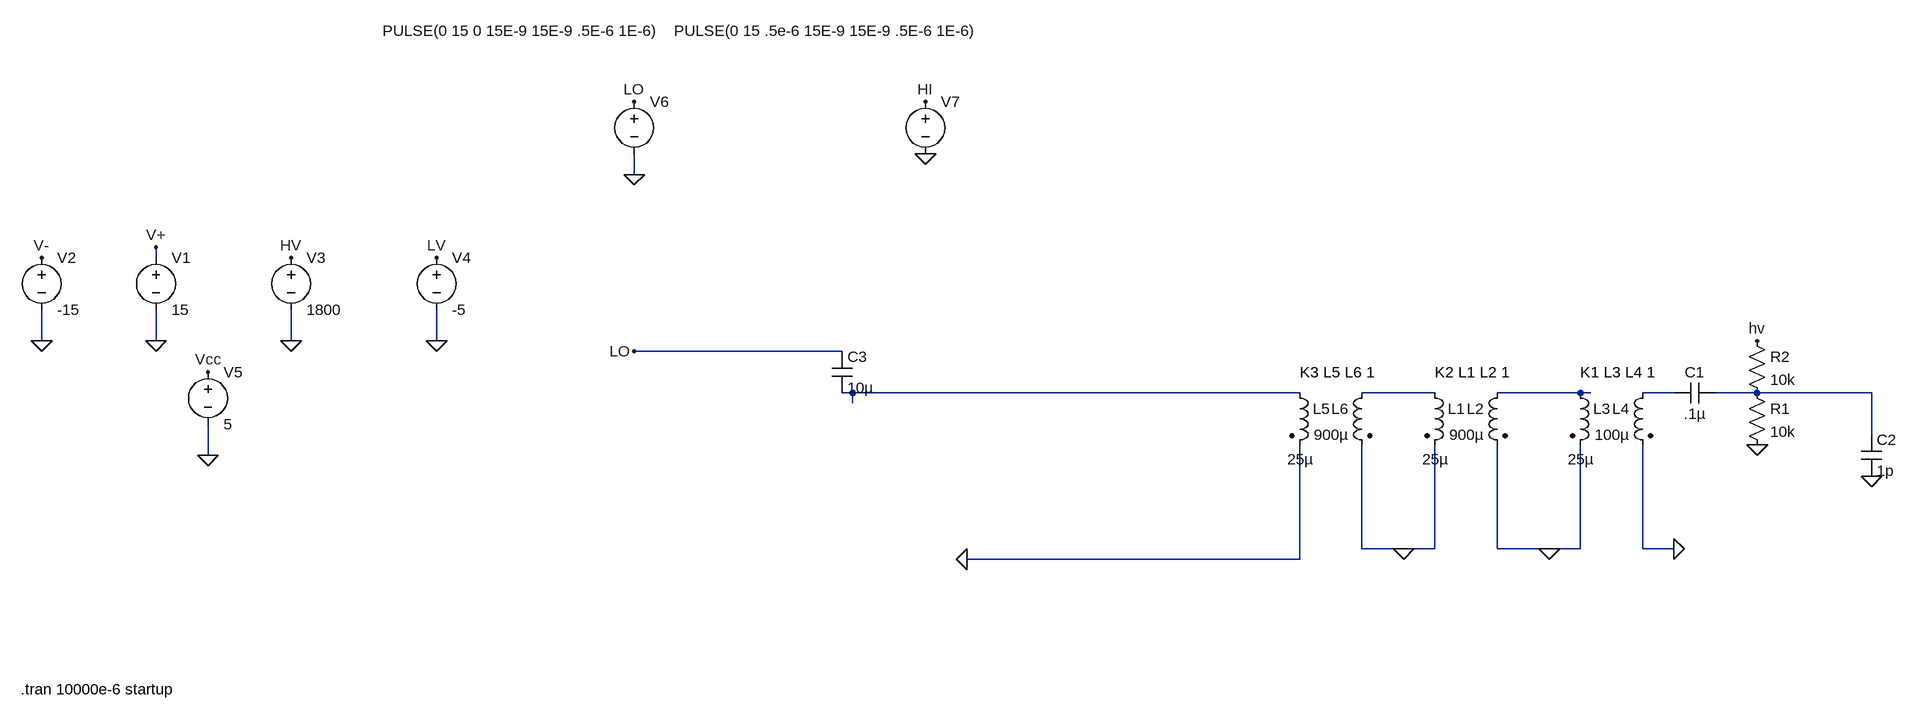
[diagram p0: schematic trafo.asc]
trafo.asc, the LTspice schematic file:
Version 4
SHEET 1 1824 692
WIRE -1168 -1376 -1168 -1408
WIRE -1904 -1248 -1904 -1264
WIRE -2080 -1120 -2080 -1168
WIRE -1904 -1120 -1904 -1168
WIRE -1696 -1120 -1696 -1168
WIRE -1472 -1120 -1472 -1168
WIRE -848 -1104 -1168 -1104
WIRE -832 -1040 -848 -1040
WIRE -144 -1040 -832 -1040
WIRE 64 -1040 -48 -1040
WIRE 288 -1040 160 -1040
WIRE 304 -1040 288 -1040
WIRE 432 -1040 384 -1040
WIRE 560 -1040 496 -1040
WIRE 736 -1040 560 -1040
WIRE -832 -1024 -832 -1040
WIRE 736 -976 736 -1040
WIRE -1824 -944 -1824 -992
WIRE -48 -800 -48 -960
WIRE 16 -800 -48 -800
WIRE 64 -800 64 -960
WIRE 64 -800 16 -800
WIRE 160 -800 160 -960
WIRE 240 -800 160 -800
WIRE 288 -800 288 -960
WIRE 288 -800 240 -800
WIRE 384 -800 384 -960
WIRE 432 -800 384 -800
WIRE -144 -784 -144 -960
WIRE -144 -784 -656 -784
FLAG -1696 -1120 0
FLAG -1696 -1248 HV
FLAG -1472 -1120 0
FLAG -1472 -1248 LV
FLAG -1904 -1120 0
FLAG -1904 -1264 V+
FLAG -1824 -944 0
FLAG -1824 -1072 Vcc
FLAG -1168 -1376 0
FLAG -1168 -1488 LO
FLAG -2080 -1248 V-
FLAG -2080 -1120 0
FLAG -1168 -1104 LO
FLAG -720 -1408 0
FLAG -720 -1488 HI
FLAG 432 -800 0
FLAG 736 -912 0
FLAG 560 -1120 hv
FLAG 560 -960 0
FLAG 16 -800 0
FLAG 240 -800 0
FLAG -656 -784 0
SYMBOL voltage -1696 -1264 R0
WINDOW 123 0 0 Left 2
WINDOW 39 0 0 Left 2
SYMATTR InstName V3
SYMATTR Value 1800
SYMBOL voltage -1472 -1264 R0
WINDOW 123 0 0 Left 2
WINDOW 39 0 0 Left 2
SYMATTR InstName V4
SYMATTR Value -5
SYMBOL ind2 -160 -1056 R0
WINDOW 3 -3 118 Left 2
SYMATTR Value 25µ
SYMATTR InstName L5
SYMATTR SpiceLine Rser=.05
SYMBOL ind2 -32 -1056 M0
SYMATTR InstName L6
SYMATTR Value 900µ
SYMATTR SpiceLine Rser=.18
SYMBOL voltage -1904 -1264 R0
WINDOW 123 0 0 Left 2
WINDOW 39 0 0 Left 2
SYMATTR InstName V1
SYMATTR Value 15
SYMBOL voltage -1824 -1088 R0
WINDOW 123 0 0 Left 2
WINDOW 39 0 0 Left 2
SYMATTR InstName V5
SYMATTR Value 5
SYMBOL voltage -1168 -1504 R0
WINDOW 3 -387 -93 Left 2
WINDOW 123 0 0 Left 2
WINDOW 39 0 0 Left 2
SYMATTR Value PULSE(0 15 0 15E-9 15E-9 .5E-6 1E-6)
SYMATTR InstName V6
SYMBOL voltage -2080 -1264 R0
WINDOW 123 0 0 Left 2
WINDOW 39 0 0 Left 2
SYMATTR InstName V2
SYMATTR Value -15
SYMBOL voltage -720 -1504 R0
WINDOW 3 -387 -93 Left 2
WINDOW 123 0 0 Left 2
WINDOW 39 0 0 Left 2
SYMATTR Value PULSE(0 15 .5e-6 15E-9 15E-9 .5E-6 1E-6)
SYMATTR InstName V7
SYMBOL ind2 48 -1056 R0
WINDOW 3 -3 118 Left 2
SYMATTR Value 25µ
SYMATTR InstName L1
SYMATTR SpiceLine Rser=.05
SYMBOL ind2 176 -1056 M0
SYMATTR InstName L2
SYMATTR Value 900µ
SYMATTR SpiceLine Rser=.18
SYMBOL ind2 272 -1056 R0
WINDOW 3 -3 118 Left 2
SYMATTR Value 25µ
SYMATTR InstName L3
SYMATTR SpiceLine Rser=.1
SYMBOL ind2 400 -1056 M0
SYMATTR InstName L4
SYMATTR Value 100µ
SYMATTR SpiceLine Rser=.2
SYMBOL cap 496 -1056 R90
WINDOW 0 0 32 VBottom 2
WINDOW 3 32 32 VTop 2
SYMATTR InstName C1
SYMATTR Value .1µ
SYMBOL cap 720 -976 R0
SYMATTR InstName C2
SYMATTR Value 1p
SYMBOL res 544 -1056 R0
SYMATTR InstName R1
SYMATTR Value 10k
SYMBOL res 544 -1136 R0
SYMATTR InstName R2
SYMATTR Value 10k
SYMBOL cap -864 -1104 R0
SYMATTR InstName C3
SYMATTR Value 10µ
TEXT -144 -1072 Left 2 !K3 L5 L6 1
TEXT -2112 -584 Left 2 !.tran 10000e-6 startup
TEXT 64 -1072 Left 2 !K2 L1 L2 1
TEXT 288 -1072 Left 2 !K1 L3 L4 1

The netlist it stands for:
* trafo.asc
V3 HV 0 1800
V4 LV 0 -5
L5 N001 0 25µ Rser=.05
L6 N002 0 900µ Rser=.18
V1 V+ 0 15
V5 Vcc 0 5
V6 LO 0 PULSE(0 15 0 15E-9 15E-9 .5E-6 1E-6)
V2 V- 0 -15
V7 HI 0 PULSE(0 15 .5e-6 15E-9 15E-9 .5E-6 1E-6)
L1 N002 0 25µ Rser=.05
L2 N003 0 900µ Rser=.18
L3 N003 0 25µ Rser=.1
L4 N004 0 100µ Rser=.2
C1 N005 N004 .1µ
C2 N005 0 1p
R1 N005 0 10k
R2 HV N005 10k
C3 LO N001 10µ
K3 L5 L6 1
.tran 10000e-6 startup
K2 L1 L2 1
K1 L3 L4 1
.backanno
.end